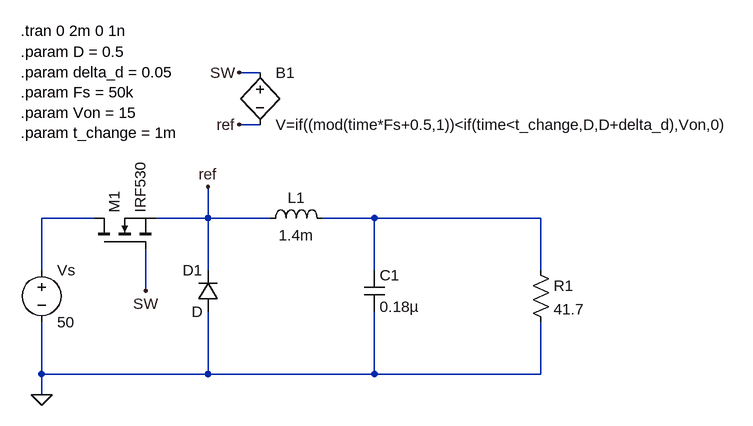
[diagram p0: schematic buck.asc]
buck.asc, the LTspice schematic file:
Version 4.1
SHEET 1 1064 848
WIRE -1264 -848 -1296 -848
WIRE -1264 -768 -1296 -768
WIRE -1520 -624 -1600 -624
WIRE -1344 -624 -1344 -672
WIRE -1344 -624 -1424 -624
WIRE -1248 -624 -1344 -624
WIRE -1088 -624 -1168 -624
WIRE -832 -624 -1088 -624
WIRE -1600 -544 -1600 -624
WIRE -1344 -544 -1344 -624
WIRE -1088 -544 -1088 -624
WIRE -832 -544 -832 -624
WIRE -1440 -512 -1440 -576
WIRE -1600 -384 -1600 -464
WIRE -1344 -384 -1344 -480
WIRE -1344 -384 -1600 -384
WIRE -1088 -384 -1088 -480
WIRE -1088 -384 -1344 -384
WIRE -832 -384 -832 -464
WIRE -832 -384 -1088 -384
WIRE -1600 -352 -1600 -384
FLAG -1296 -848 SW
FLAG -1440 -512 SW
FLAG -1600 -352 0
FLAG -1296 -768 ref
FLAG -1344 -672 ref
SYMBOL voltage -1600 -560 R0
SYMATTR InstName Vs
SYMATTR Value 50
SYMBOL cap -1104 -544 R0
SYMATTR InstName C1
SYMATTR Value 0.18µ
SYMBOL res -848 -560 R0
SYMATTR InstName R1
SYMATTR Value 41.7
SYMBOL nmos -1520 -576 R270
SYMATTR InstName M1
SYMATTR Value IRF530
SYMBOL diode -1328 -480 R180
WINDOW 0 24 64 Left 2
WINDOW 3 24 0 Left 2
SYMATTR InstName D1
SYMBOL ind -1264 -608 R270
WINDOW 0 32 56 VTop 2
WINDOW 3 5 56 VBottom 2
SYMATTR InstName L1
SYMATTR Value 1.4m
SYMATTR SpiceLine Rser=0
SYMBOL bv -1264 -864 R0
SYMATTR InstName B1
SYMATTR Value V=if((mod(time*Fs+0.5,1))<if(time<t_change,D,D+delta_d),Von,0)
TEXT -1632 -912 Left 2 !.tran 0 2m 0 1n
TEXT -1632 -880 Left 2 !.param D = 0.5\n.param delta_d = 0.05\n.param Fs = 50k\n.param Von = 15\n.param t_change = 1m

The netlist it stands for:
* buck.asc
Vs N001 0 50
C1 N002 0 0.18µ
R1 N002 0 41.7
M1 N001 SW ref ref IRF530
D1 0 ref D
L1 ref N002 1.4m Rser=0
B1 SW ref V=if((mod(time*Fs+0.5,1))<if(time<t_change,D,D+delta_d),Von,0)
.model D D
.lib standard.dio
.model NMOS NMOS
.model PMOS PMOS
.lib standard.mos
.tran 0 2m 0 1n
.param D = 0.5
.param delta_d = 0.05
.param Fs = 50k
.param Von = 15
.param t_change = 1m
.backanno
.end